# Altium schematic sheet top.SchDoc
size A4; SheetNumber: 1; SheetTotal: 3; SPICEModelCacheAWJVRFAX: <root> / <DocumentId>AWJVRFAX</DocumentId> / </root>
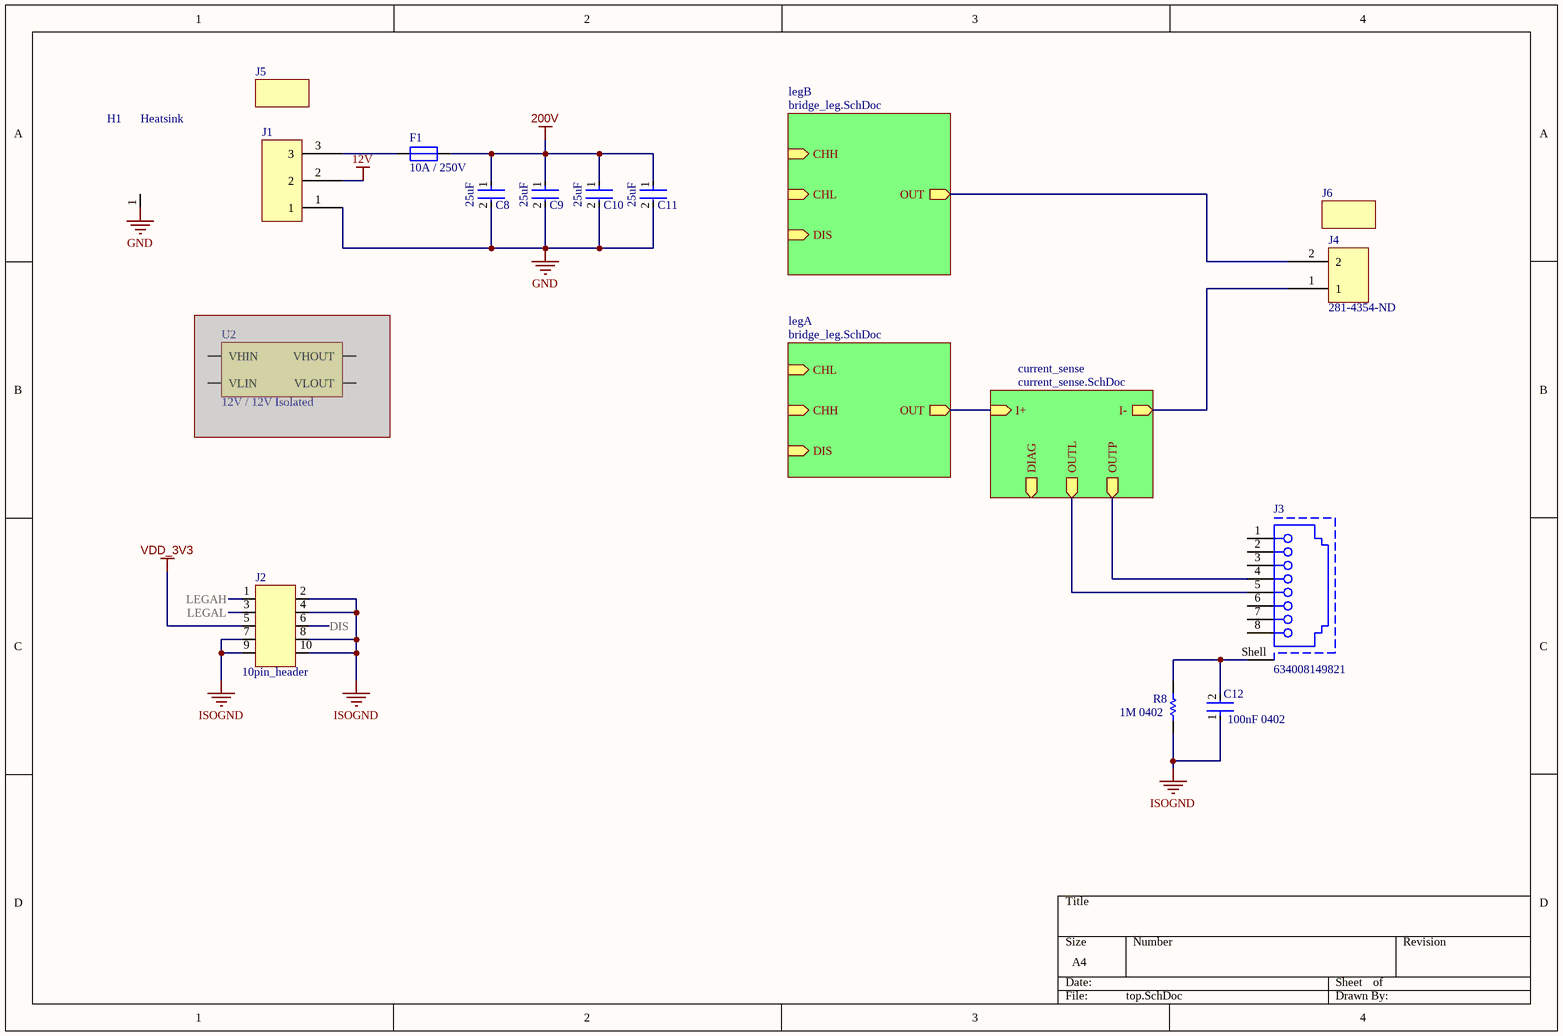
[diagram p0: top.SchDoc]

## Parts
C8  25uF  [film_cap_50uF]
C9  25uF  [film_cap_50uF]
C10  25uF  [film_cap_50uF]
C11  25uF  [film_cap_50uF]
C12  100nF 0402  [CAP 0402_1005 RF]
F1  10A / 250V  [fuseholder_5mm_20mm]
H1  Heatsink  [HEATSINK2]
J1  20A Socket 3Pin  [weidmuller_3p_20A]  (value not drawn)
J2  10pin_header  [header_10]
J3  634008149821  [634008149821]
J4  Supplier Part Number 1: 281-4354-ND  [weidmuller_19A_2p_m]  (hidden comment: weidmuller_20A_2p_f)
J5  20A Power Plug 3 Pin  (value not drawn)
J6  20A Power Plug 2 Pin  (value not drawn)
R8  1M 0402  [RES 0402_1005]
U2  12V / 12V Isolated  [gatesupply]  (masked out: inside a compile mask, not in the netlist)

## Sub-sheets
current_sense = current_sense.SchDoc: I+ (in), I- (out), DIAG (out), OUTP (out), OUTL (out)
legA = bridge_leg.SchDoc: CHL (in), CHH (in), DIS (in), OUT (out)
legB = bridge_leg.SchDoc: CHH (in), CHL (in), DIS (in), OUT (out)

## Nets
12V: J1.2
200V: C8.1 C9.1 C10.1 C11.1 F1.1
GND: C8.2 C9.2 C10.2 C11.2 H1.1 J1.1
ISOGND: C12.1 J2.2 J2.4 J2.7 J2.8 J2.9 J2.10 R8.2
VDD_3V3: J2.5
DIS: J2.6
LEGAH: J2.1
LEGAL: J2.3
NetC12_2: C12.2 J3.Shell R8.1
NetF1_2: F1.2 J1.3
NetJ3_4: J3.4 ; sheet current_sense/OUTP
NetJ3_5: J3.5 ; sheet current_sense/OUTL
NetJ4_1: J4.1 ; sheet current_sense/I-
NetJ4_2: J4.2 ; sheet legB/OUT
(unnamed): sheet legA/OUT, sheet current_sense/I+

Not connected (* = marked no-connect by the designer): J3 1 2 3 6 7 8

## Library data of the parts
C8-C11 = b4654b650e69147ec39a6b967a45e02: FIlm Cap 25uF 450V; Voltage: 50V; Tolerance: 5%; Dielectric: C0G; Insulation Resistance: 1GR; Dissipation Factor: 2.5%; Temperature Coefficient: 30ppm/°C; Capacitance: 100pF; REACH SVHC: No SVHC; Termination: SMD/SMT; Construction: Flat; Contact Plating: Tin; Width: 0.02inch; Series: -; Voltage Rating (DC): 50V; Voltage Rating: 50V; Height: 0.56mm; Max Operating Temperature: 125°C; Length: 1mm; Lead Free: Lead Free; Case/Package: 0402; Min Operating Temperature: -55°C; Depth: 0.5mm; Case Code (Metric): 1005; Thickness: 0.022inch; Radiation Hardening: No; Case Code (Imperial): 0402; Mount: Surface Mount; Packaging: Tape and Reel; Package Quantity: 1; RoHS Compliant: Yes
C12 = b4654b650e69147ec39a6b967a45e02: MLCC 0402 100nF; Voltage: 50V; Tolerance: 5%; Dielectric: C0G; Insulation Resistance: 1GR; Dissipation Factor: 2.5%; Temperature Coefficient: 30ppm/°C; REACH SVHC: No SVHC; Termination: SMD/SMT; Construction: Flat; Contact Plating: Tin; Width: 0.02inch; Series: -; Voltage Rating (DC): 50V; Voltage Rating: 50V; Height: 0.56mm; Max Operating Temperature: 125°C; Length: 1mm; Lead Free: Lead Free; Case/Package: 0402; Min Operating Temperature: -55°C; Depth: 0.5mm; Case Code (Metric): 1005; Thickness: 0.022inch; Radiation Hardening: No; Case Code (Imperial): 0402; Mount: Surface Mount; Capacitance: 100nF; Packaging: Tape and Reel; Package Quantity: 1; RoHS Compliant: Yes; Supplier 1: Future Electronics; Supplier Part Number 1: 5964861
F1 = fuse: Fuse Holder 5mm/20mm; Supplier 1: Rs; Supplier Part Number 1: 2693785
H1 = heatsink_2: HEATSINK TO247 W/CLIP 75MM; Supplier 1: Mouser; Supplier Part Number 1: 567-694-75
J1 = wuerth_connector_straight_30_20A_691311500103: Supplier 1: Rs; Supplier Part Number 1: 1722945
J2 = 10pin_header: Pin header male 2x5 2.54mm; Supplier 1: Digikey; Supplier Part Number 1: 1175-1754-ND
J3 = CMP-1502-01719-2: NexarPartId: 52676018; Current Rating: 1.5A; Contact Resistance: 20mΩ; Operating Supply Voltage: 120V; Insulation Resistance: 500MΩ; Number of Ports: 1; Shielding: Shielded; Direction: Up; Min Operating Temperature: -40°C; Housing Color: Black; Max Operating Temperature: 85°C; Contact Plating: Gold; Number of Rows: 1; Termination: Solder; Mount: Surface Mount; RoHS: Compliant; Housing Material: Nylon
J4 = weidmuller_20A_2p_f: Connector Block 19A Male Receptor; Supplier 1: Digi-Key
J5 J6 = weidmuller_3pin_male: Supplier 1: Rs
  J5: Supplier Part Number 1: 1722695
  J6: Supplier Part Number 1: 1722635
R8 = Res1: Resistor 10MOhm 0603; Value: 1Meg; Published: 8-Jun-2000; LatestRevisionDate: 17-Jul-2002; LatestRevisionNote: Re-released for DXP Platform.; PackageReference: AXIAL-0.3; Publisher: Altium Limited; PackageDescription: Axial Device, Thru-Hole; 2 Leads; 0.3 in Pin Spacing; Supplier 1: Mouser; Supplier Part Number 1: 279-CRGP0402F1M0
U2 = gatesupply: Supplier 1: Digikey; Supplier Part Number 1: 811-3184-1-ND